# EAGLE design 5ObstacleNAND (EAGLE 9.6.2)
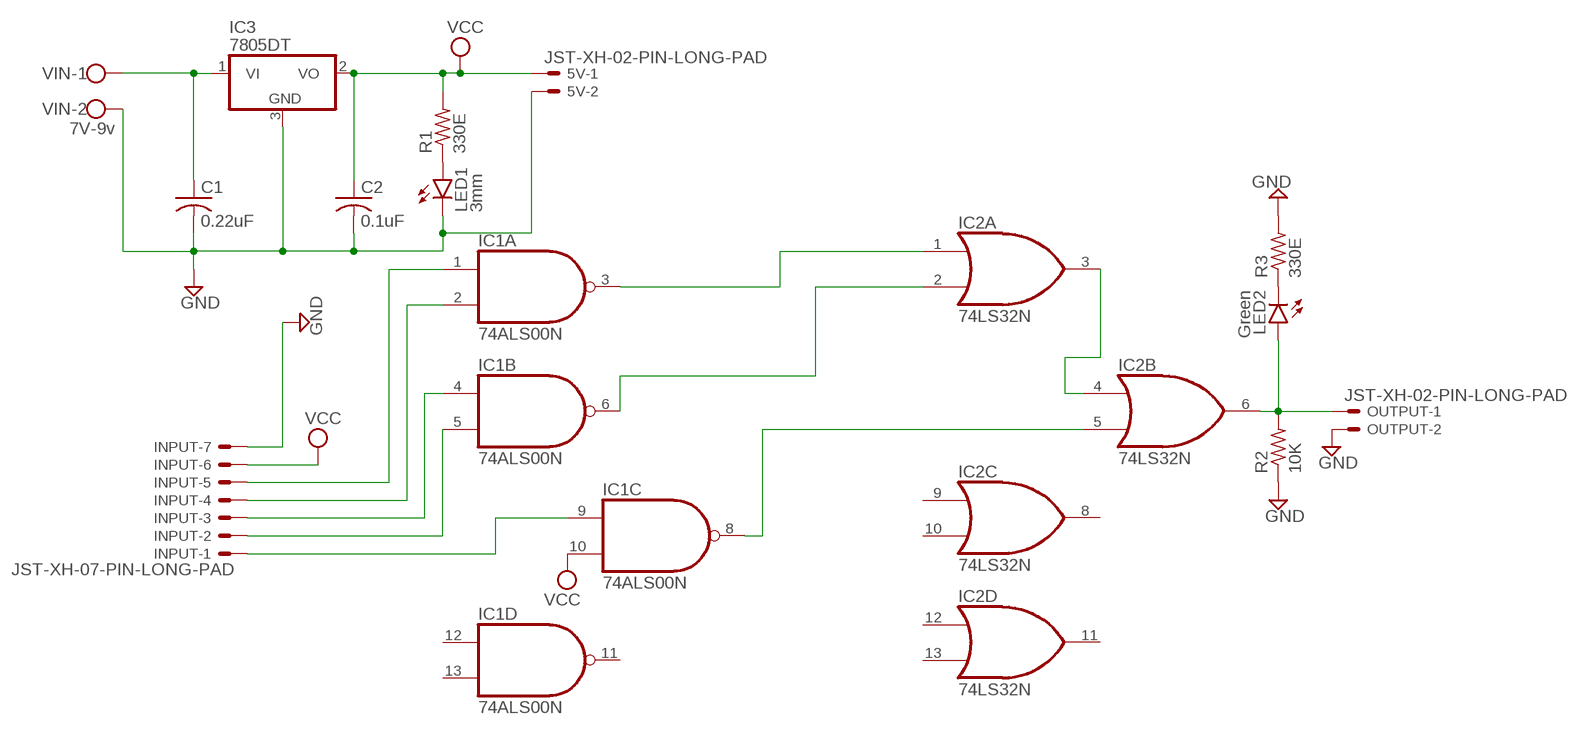
[diagram p0: schematic, sheet 1]

## Parts
5V  JST-XH-02-PIN-LONG-PAD  [JST-XH-02-PACKAGE-LONG-PAD]
C1  0.22uF  C-USC0805  [C0805]
C2  0.1uF  C-USC0805  [C0805]
IC1  74ALS00N  [DIL14]
IC2  74LS32N  [DIL14]
IC3  7805DT  [TO252]
INPUT  JST-XH-07-PIN-LONG-PAD  [JST-XH-07-PACKAGE-LONG-PAD]
LED1  3mm  LEDSML0805  [SML0805]
LED2  Green  LEDSML0805  [SML0805]
OUTPUT  JST-XH-02-PIN-LONG-PAD  [JST-XH-02-PACKAGE-LONG-PAD]
R1  330E  R-US_R0805  [R0805]
R2  10K  R-US_R0805  [R0805]
R3  330E  R-US_R0805  [R0805]
VIN  7V-9v  W237-102  [W237-102]

## Nets
GND: 5V.2 C1.2 C2.2 IC3.3(GND) INPUT.7 LED1.C OUTPUT.2 R2.1 R3.2 VIN.2
N$1: IC1.1(A:I0) INPUT.5
N$2: IC1.2(A:I1) INPUT.4
N$3: IC1.4(B:I0) INPUT.3
N$4: IC1.5(B:I1) INPUT.2
N$5: IC1.9(C:I0) INPUT.1
N$6: IC1.3(A:O) IC2.1(A:I0)
N$7: IC1.6(B:O) IC2.2(A:I1)
N$8: IC2.3(A:O) IC2.4(B:I0)
N$9: IC1.8(C:O) IC2.5(B:I1)
N$10: IC2.6(B:O) LED2.A OUTPUT.1 R2.2
N$11: LED2.C R3.1
N$12: LED1.A R1.1
N$13: C1.1 IC3.1(VI) VIN.1
VCC: 5V.1 C2.1 IC1.10(C:I1) IC3.2(VO) INPUT.6 R1.2
Unconnected: IC1.11(D:O) IC1.12(D:I0) IC1.13(D:I1) IC2.8(C:O) IC2.9(C:I0) IC2.10(C:I1) IC2.11(D:O) IC2.12(D:I0) IC2.13(D:I1)

## Power pins joined to a net without a drawn wire
GND: IC1.7(P:GND) IC2.7(P:GND)
VCC: IC1.14(P:VCC) IC2.14(P:VCC)

## Library data of the parts
5V OUTPUT = Rembrandt Electronics - JST XH Connectors v1-0:JST-XH-02-PIN: JST XH Connector 2 Pin Wire to board connector. Pitch: 2,54 mm, (0.100") Number of pins: 2 Created by Rembrandt Electronics www.rembrandtelectronics.com
C1 C2 = adafruit:C-US: CAPACITOR, American symbol
IC1 = 74xx-us:74*00: Quad 2-input NAND gate
IC2 = 74xx-us:74*32: Quad 2-input OR gate
IC3 = adafruit:78*: Positive VOLTAGE REGULATOR Added bigger pads to the TO-92 package
INPUT = Rembrandt Electronics - JST XH Connectors v1-0:JST-XH-07-PIN: JST XH Connector 2 Pin Wire to board connector. Pitch: 2,54 mm, (0.100") Number of pins: 7 Created by Rembrandt Electronics www.rembrandtelectronics.com
LED1 LED2 = led:LED: LED OSRAM: - CHIPLED LG R971, LG N971, LY N971, LG Q971, LY Q971, LO R971, LY R971 LH N974, LH R974 LS Q976, LO Q976, LY Q976 LO Q996 - Hyper CHIPLED LW Q18S LB Q993, LB Q99A, LB R99A - SideLED LS A670, LO A670, LY A670, LG A670, LP A670 LB A673, LV A673, LT A673, LW A673 LH A674 LY A675 LS A676, LA A676, LO A676, LY A676, LW A676 LS A679, LY A679, LG A679 - Hyper Micro SIDELED® LS Y876, LA Y876, LO Y876, LY Y876 LT Y87S - SmartLED LW L88C, LW L88S LB L89C, LB L89S, LG L890 LS L89K, LO L89K, LY L89K LS L896, LA L896, LO L896, LY L896 - TOPLED LS T670, LO T670, LY T670, LG T670, LP T670 LSG T670, LSP T670, LSY T670, LOP T670, LYG T670 LG T671, LOG T671, LSG T671 LB T673, LV T673, LT T673, LW T673 LH T674 LS T676, LA T676, LO T676, LY T676, LB T676, LH T676, LSB T676, LW T676 LB T67C, LV T67C, LT T67C, LS T67K, LO T67K, LY T67K, LW E67C LS E67B, LA E67B, LO E67B, LY E67B, LB E67C, LV E67C, LT E67C LW T67C LS T679, LY T679, LG T679 LS T770, LO T770, LY T770, LG T770, LP T770 LB T773, LV T773, LT T773, LW T773 LH T774 LS E675, LA E675, LY E675, LS T675 LS T776, LA T776, LO T776, LY T776, LB T776 LHGB T686 LT T68C, LB T68C - Hyper Mini TOPLED® LB M676 - Mini TOPLED Santana® LG M470 LS M47K, LO M47K, LY M47K Source: http://www.osram.convergy.de LUXEON: - LUMILED® LXK2-PW12-R00, LXK2-PW12-S00, LXK2-PW14-U00, LXK2-PW14-V00 LXK2-PM12-R00, LXK2-PM12-S00, LXK2-PM14-U00 LXK2-PE12-Q00, LXK2-PE12-R00, LXK2-PE12-S00, LXK2-PE14-T00, LXK2-PE14-U00 LXK2-PB12-K00, LXK2-PB12-L00, LXK2-PB12-M00, LXK2-PB14-N00, LXK2-PB14-P00, LXK2-PB14-Q00 LXK2-PR12-L00, LXK2-PR12-M00, LXK2-PR14-Q00, LXK2-PR14-R00 LXK2-PD12-Q00, LXK2-PD12-R00, LXK2-PD12-S00 LXK2-PH12-R00, LXK2-PH12-S00 LXK2-PL12-P00, LXK2-PL12-Q00, LXK2-PL12-R00 Source: www.luxeon.com KINGBRIGHT: KA-3528ASYC Source: www.kingbright.com
R1-R3 = rcl:R-US_: RESISTOR, American symbol; SPICEPREFIX: R
VIN = con-wago-500:W237-102: WAGO SCREW CLAMP; MPN: 237-102; OC_FARNELL: unknown; OC_NEWARK: 70K9898

## Board
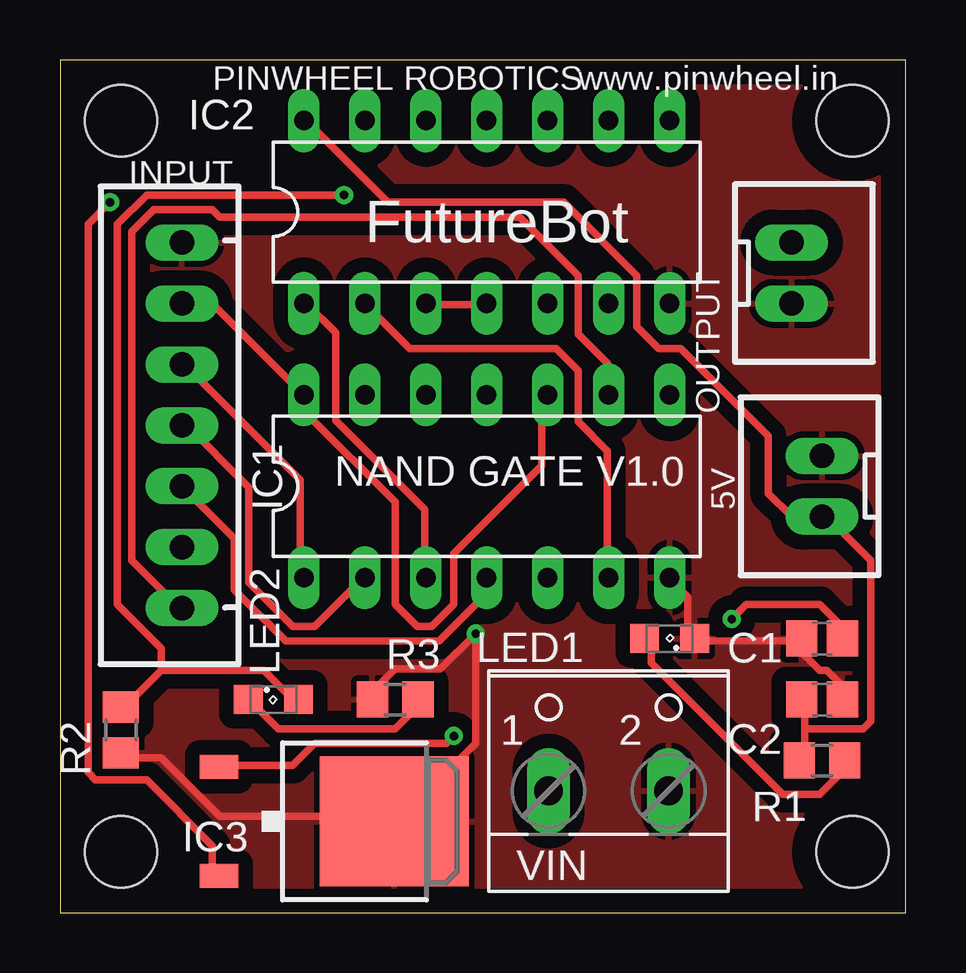
[diagram p1: board, top side]
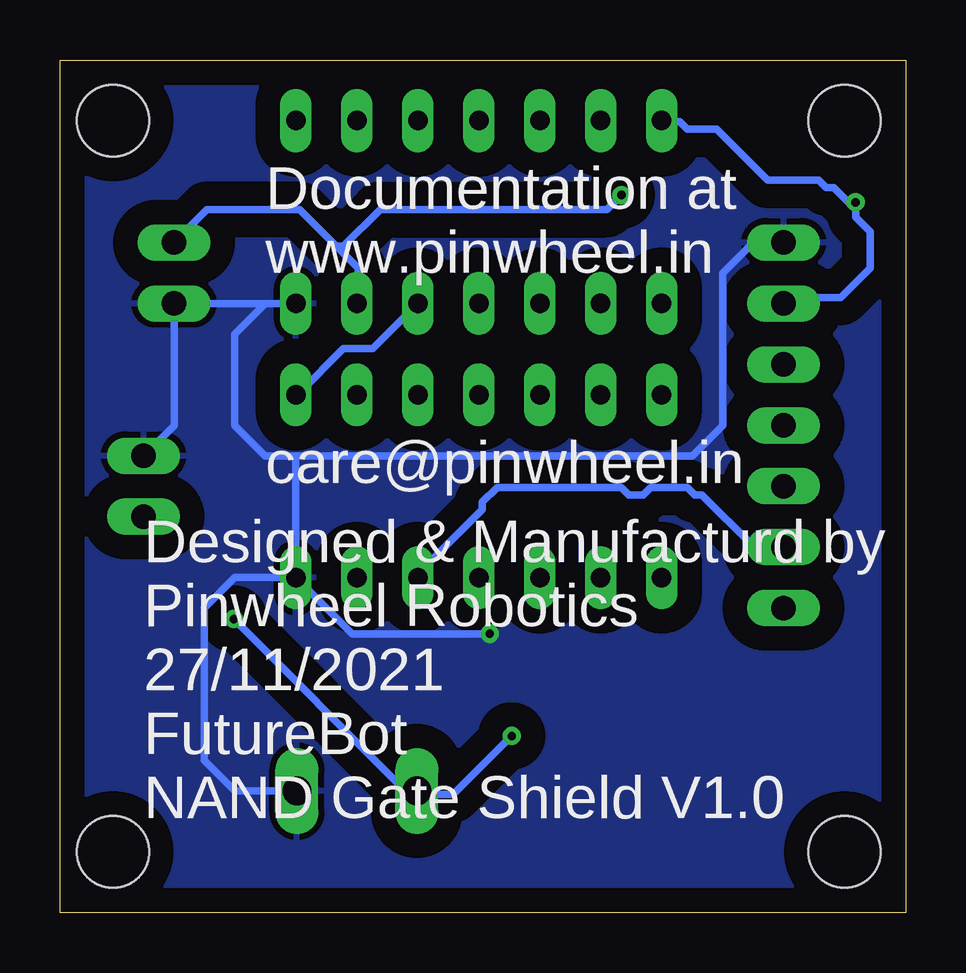
[diagram p2: board, bottom side, seen from below]

Size 35.23 x 35.55 mm. Coordinates in mm from the lower left corner, seen from the top.
Outline: 0,0 35.23,0 35.23,35.55 0,35.55 0,0
Copper layers (1*16): Top 0.035mm / dielectric 1.5mm / Bottom 0.035mm
Design rules "default *": minimum track width 12mil, minimum drill 0.35mm, track to track 12mil, track to pad 12mil, pad to pad 12mil, via to via 12mil, smd to smd 6mil, copper to edge 40mil, drill to drill 12mil, minimum pad ring 10mil, minimum via ring 8mil, stop-mask expansion 4mil, vias tented up to drill 0mil, thermal gap 10mil
Holes 3 mm at 2.54,33.02 33.02,33.02 2.54,2.54 33.02,2.54

### Footprints (pad centres in the part's own frame; a part is rotated, then mirrored left to right if it is on the bottom)
JST-XH-02-PACKAGE-LONG-PAD = drill 1.016 long: 1 -1.27,0; 2 1.27,0
C0805 = smd 1.3 x 1.5: 1 -0.85,0; 2 0.85,0
DIL14 = drill 0.813 long: 1 -7.62,-3.81; 2 -5.08,-3.81; 3 -2.54,-3.81; 4 0,-3.81; 5 2.54,-3.81; 6 5.08,-3.81; 7 7.62,-3.81; 8 7.62,3.81; 9 5.08,3.81; 10 2.54,3.81; 11 0,3.81; 12 -2.54,3.81; 13 -5.08,3.81; 14 -7.62,3.81
TO252 = smd 1 x 1.6: 1 -2.28,-4.8; 2 2.28,-4.8 | smd 5.4 x 6.2: 3 0,2.5
JST-XH-07-PACKAGE-LONG-PAD = drill 1.016 long: 1 -7.62,0; 2 -5.08,0; 3 -2.54,0; 4 0,0; 5 2.54,0; 6 5.08,0; 7 7.62,0
SML0805 = smd 1.2 x 1.2: A 1.05,0; C -1.05,0
R0805 = smd 1.3 x 1.5: 1 -0.95,0; 2 0.95,0
W237-102 = drill 1.194 long: 1 -2.5,-1.27; 2 2.5,-1.27

### Placement (x,y rotation side)
5V  31.75,17.78 90 top
C1  31.75,11.43 180 top
C2  31.75,8.89 0 top
IC1  17.78,17.78 0 top
IC2  17.78,29.21 0 top
IC3  11.43,3.81 270 top
INPUT  5.08,20.32 90 top
LED1  25.4,11.43 180 top
LED2  8.89,8.89 0 top
OUTPUT  30.48,26.67 270 top
R1  31.75,6.35 180 top
R2  2.54,7.62 90 top
R3  13.97,8.89 180 top
VIN  22.86,6.35 0 top

### Tracks (layer width: path | path; a pad name or v marks a point on that pad's centre or on a via)
GND  (via drill 0.35)
  Top 0.305: IC1.7 25.55,13.77 26.16,13.16 26.16,11.63 LED1.C 26.47,11.33 30.43,11.33 | 30.43,11.33 30.73,11.33 C1.2 30.43,11.33 | 30.43,11.33 31.65,10.11 31.95,10.11 32.56,9.5 32.56,8.89 C2.2 | R2.1 2.69,6.45 4.22,6.45 6.65,4.01 13.66,4.01 IC3.3 13.97,3.71 17.32,7.06 17.32,8.59 v17.32,11.63 15.85,10.16 13.97,10.16 13.02,9.21 R3.2
  Bottom 0.305: INPUT.7 6.35,27.94 7.62,26.67 7.62,20.32 8.89,19.05 25.4,19.05 | 25.4,19.05 26.67,19.05 27.94,20.32 27.94,24.13 26.67,25.4 IC2.7 OUTPUT.2 30.48,20.32 5V.2 | IC1.7 23.06,11.63 v17.32,11.63 | IC1.7 25.4,19.05 | IC1.7 27.94,13.97 29.21,12.7 29.21,6.35 27.94,5.08 VIN.2
  pour Bottom (isolate 1.016): 0,35.56 35.56,35.56 35.56,0 0,0
  pour Top (isolate 0.61): 0,35.56 35.56,35.56 35.56,0 0,0
N$1
  Top 0.305: IC1.1 10.01,14.07 10.01,18.03 5.13,22.91 INPUT.5
N$2
  Top 0.305: IC1.2 12.45,13.77 10.62,11.94 9.7,11.94 7.87,13.77 7.87,17.73 5.13,20.47 INPUT.4
N$3
  Top 0.305: INPUT.3 7.26,15.6 7.26,13.46 9.4,11.33 15.8,11.33 17.63,13.16 17.63,13.77 IC1.4
N$4
  Bottom 0.305: IC1.5 20.07,14.07 20.07,14.38 17.63,16.82 17.63,17.12 17.02,17.73 11.84,17.73 11.53,17.42 10.92,17.42 10.62,17.73 9.09,17.73 8.79,17.42 8.48,17.42 6.35,15.29 5.13,15.29 INPUT.2
N$5
  Top 0.305: IC1.9 22.81,21.69 22.81,22.91 21.59,24.13 21.59,26.57 19.15,29.01 6.65,29.01 6.35,29.31 3.91,29.31 3,28.4 3,14.68 4.83,12.85 INPUT.1
N$6
  Top 0.305: IC1.3 15.19,14.07 15.19,16.82 11.48,20.52 11.48,24.18 10.26,25.4 IC2.1
N$7
  Top 0.305: IC2.2 14.58,23.52 20.68,23.52 21.59,22.61 21.59,20.47 22.81,19.25 22.81,14.07 IC1.6
N$8
  Top 0.305: IC2.3 15.49,25.35 17.63,25.35 IC2.4
N$9
  Bottom 0.305: IC2.5 22.2,23.52 23.42,23.52 25.25,21.69 IC1.8
N$10  (via drill 0.35)
  Top 0.305: 4.22,10.11 8.48,10.11 9.7,8.89 LED2.A | 4.22,10.11 2.69,8.59 R2.2 | 4.22,10.11 4.22,11.02 2.39,12.85 2.39,28.7 3.61,29.92 v11.84,29.92
  Bottom 0.305: 23.72,27.79 25.25,29.31 29.11,29.31 OUTPUT.1 | 23.72,27.79 22.81,26.87 22.81,25.65 IC2.6 | v11.84,29.92 12.45,29.31 21.89,29.31 23.42,27.79 23.72,27.79
N$11
  Top 0.305: LED2.C 7.87,8.89 9.09,7.67 13.97,7.67 15.19,8.89 R3.1
N$12
  Top 0.305: LED1.A 24.64,11.33 24.64,10.41 30.12,4.93 31.65,4.93 32.87,6.15 R1.1
N$13  (via drill 0.35)
  Top 0.305: v27.99,12.24 28.6,12.85 31.65,12.85 32.56,11.94 32.56,11.63 C1.1 | v16.41,7.37 16.1,7.06 10.62,7.06 9.7,6.15 6.65,6.15 IC3.1
  Bottom 0.305: v27.99,12.24 20.98,5.23 20.37,5.23 VIN.1 20.07,4.93 18.85,4.93 v16.41,7.37
VCC  (via drill 0.35)
  Top 0.305: v2.08,29.62 1.17,28.7 1.17,5.84 1.47,5.54 3.61,5.54 6.35,2.79 6.35,1.57 IC3.2 | IC1.10 20.07,21.39 20.07,18.64 16.41,14.99 16.41,12.85 15.49,11.94 14.88,11.94 13.97,12.85 13.97,17.12 10.31,20.78 10.31,21.39 IC1.14 6.35,25.4 INPUT.6 | 31.04,7.67 31.04,8.89 C2.1 | 31.04,7.67 31.04,6.45 R1.2 | 31.04,7.67 33.48,7.67 33.78,7.98 33.78,14.68 31.95,16.51 5V.1 30.48,16.51 29.52,17.47 29.52,19.86 25.86,23.52 24.94,23.52 24.03,24.43 24.03,26.57 20.98,29.62 13.66,29.62 10.31,32.97 IC2.14
  Bottom 0.305: INPUT.6 4.83,25.65 2.69,25.65 1.47,26.87 1.47,28.4 2.08,29.01 v2.08,29.62 2.39,29.62 3,30.23 3.3,30.23 3.61,30.53 5.74,30.53 7.87,32.66 9.09,32.66 9.4,32.97 10.01,32.97 IC2.14

### Text on the board
tNames: PINWHEEL ROBOTICS | www.pinwheel.in | FutureBot | NAND GATE V1.0
bNames: Documentation at / www.pinwheel.in | care@pinwheel.in | Designed & Manufacturd by / Pinwheel Robotics / 27/11/2021 / FutureBot / NAND Gate Shield V1.0